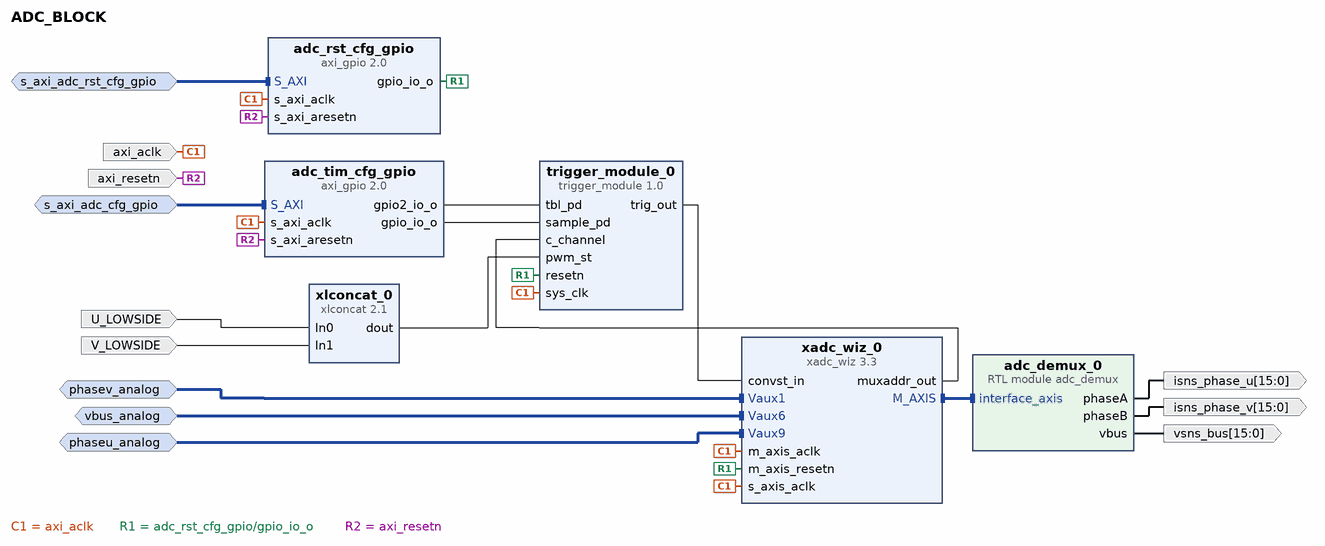
[diagram p0: block diagram of the top level]
# Vivado block design ADC_BLOCK, xc7z020clg400-1, Vivado 2021.2
create_bd_design ADC_BLOCK

create_bd_intf_port -mode Slave -vlnv xilinx.com:interface:diff_analog_io_rtl:1.0 phasev_analog
create_bd_intf_port -mode Slave -vlnv xilinx.com:interface:diff_analog_io_rtl:1.0 vbus_analog
create_bd_intf_port -mode Slave -vlnv xilinx.com:interface:diff_analog_io_rtl:1.0 phaseu_analog
create_bd_intf_port -mode Slave -vlnv xilinx.com:interface:aximm_rtl:1.0 s_axi_adc_cfg_gpio
set_property -dict [list \
  CONFIG.ADDR_WIDTH 9 \
  CONFIG.ARUSER_WIDTH 0 \
  CONFIG.AWUSER_WIDTH 0 \
  CONFIG.BUSER_WIDTH 0 \
  CONFIG.DATA_WIDTH 32 \
  CONFIG.HAS_BRESP 1 \
  CONFIG.HAS_BURST 0 \
  CONFIG.HAS_CACHE 0 \
  CONFIG.HAS_LOCK 0 \
  CONFIG.HAS_PROT 0 \
  CONFIG.HAS_QOS 0 \
  CONFIG.HAS_REGION 0 \
  CONFIG.HAS_RRESP 1 \
  CONFIG.HAS_WSTRB 1 \
  CONFIG.ID_WIDTH 0 \
  CONFIG.MAX_BURST_LENGTH 1 \
  CONFIG.NUM_READ_OUTSTANDING 1 \
  CONFIG.NUM_READ_THREADS 1 \
  CONFIG.NUM_WRITE_OUTSTANDING 1 \
  CONFIG.NUM_WRITE_THREADS 1 \
  CONFIG.PROTOCOL AXI4LITE \
  CONFIG.READ_WRITE_MODE READ_WRITE \
  CONFIG.RUSER_BITS_PER_BYTE 0 \
  CONFIG.RUSER_WIDTH 0 \
  CONFIG.SUPPORTS_NARROW_BURST 0 \
  CONFIG.WUSER_BITS_PER_BYTE 0 \
  CONFIG.WUSER_WIDTH 0 \
] [get_bd_intf_ports s_axi_adc_cfg_gpio]
create_bd_intf_port -mode Slave -vlnv xilinx.com:interface:aximm_rtl:1.0 s_axi_adc_rst_cfg_gpio
set_property -dict [list \
  CONFIG.ADDR_WIDTH 9 \
  CONFIG.ARUSER_WIDTH 0 \
  CONFIG.AWUSER_WIDTH 0 \
  CONFIG.BUSER_WIDTH 0 \
  CONFIG.DATA_WIDTH 32 \
  CONFIG.HAS_BRESP 1 \
  CONFIG.HAS_BURST 0 \
  CONFIG.HAS_CACHE 0 \
  CONFIG.HAS_LOCK 0 \
  CONFIG.HAS_PROT 0 \
  CONFIG.HAS_QOS 0 \
  CONFIG.HAS_REGION 0 \
  CONFIG.HAS_RRESP 1 \
  CONFIG.HAS_WSTRB 1 \
  CONFIG.ID_WIDTH 0 \
  CONFIG.MAX_BURST_LENGTH 1 \
  CONFIG.NUM_READ_OUTSTANDING 1 \
  CONFIG.NUM_READ_THREADS 1 \
  CONFIG.NUM_WRITE_OUTSTANDING 1 \
  CONFIG.NUM_WRITE_THREADS 1 \
  CONFIG.PROTOCOL AXI4LITE \
  CONFIG.READ_WRITE_MODE READ_WRITE \
  CONFIG.RUSER_BITS_PER_BYTE 0 \
  CONFIG.RUSER_WIDTH 0 \
  CONFIG.SUPPORTS_NARROW_BURST 0 \
  CONFIG.WUSER_BITS_PER_BYTE 0 \
  CONFIG.WUSER_WIDTH 0 \
] [get_bd_intf_ports s_axi_adc_rst_cfg_gpio]
create_bd_port -dir I U_LOWSIDE
create_bd_port -dir I V_LOWSIDE
create_bd_port -dir I -type clk axi_aclk
set_property -dict [list \
  CONFIG.ASSOCIATED_BUSIF s_axi_adc_rst_cfg_gpio:s_axi_adc_cfg_gpio \
  CONFIG.FREQ_HZ 100000000 \
] [get_bd_ports axi_aclk]
create_bd_port -dir I -type rst axi_resetn
create_bd_port -dir O -from 15 -to 0 -type data isns_phase_u
create_bd_port -dir O -from 15 -to 0 -type data isns_phase_v
create_bd_port -dir O -from 15 -to 0 -type data vsns_bus

create_bd_cell -type ip -vlnv xilinx.com:ip:xadc_wiz:3.3 xadc_wiz_0
set_property -dict [list \
  CONFIG.CHANNEL_ENABLE_VAUXP1_VAUXN1 true \
  CONFIG.CHANNEL_ENABLE_VAUXP6_VAUXN6 true \
  CONFIG.CHANNEL_ENABLE_VAUXP9_VAUXN9 true \
  CONFIG.CHANNEL_ENABLE_VP_VN false \
  CONFIG.ENABLE_AXI4STREAM true \
  CONFIG.ENABLE_RESET true \
  CONFIG.ENABLE_VBRAM_ALARM false \
  CONFIG.ENABLE_VCCDDRO_ALARM false \
  CONFIG.ENABLE_VCCPAUX_ALARM false \
  CONFIG.ENABLE_VCCPINT_ALARM false \
  CONFIG.EXTERNAL_MUXADDR_ENABLE true \
  CONFIG.EXTERNAL_MUX_CHANNEL VP_VN \
  CONFIG.INTERFACE_SELECTION None \
  CONFIG.OT_ALARM false \
  CONFIG.SEQUENCER_MODE Continuous \
  CONFIG.SINGLE_CHANNEL_SELECTION TEMPERATURE \
  CONFIG.TIMING_MODE Event \
  CONFIG.USER_TEMP_ALARM false \
  CONFIG.VCCAUX_ALARM false \
  CONFIG.VCCINT_ALARM false \
  CONFIG.XADC_STARUP_SELECTION channel_sequencer \
] [get_bd_cells xadc_wiz_0]
create_bd_cell -type ip -vlnv xilinx.com:user:trigger_module:1.0 trigger_module_0
create_bd_cell -type module -reference adc_demux adc_demux_0
create_bd_cell -type ip -vlnv xilinx.com:ip:xlconcat:2.1 xlconcat_0
create_bd_cell -type ip -vlnv xilinx.com:ip:axi_gpio:2.0 adc_rst_cfg_gpio
set_property -dict {CONFIG.C_ALL_OUTPUTS 1 CONFIG.C_GPIO_WIDTH 1} [get_bd_cells adc_rst_cfg_gpio]
create_bd_cell -type ip -vlnv xilinx.com:ip:axi_gpio:2.0 adc_tim_cfg_gpio
set_property -dict {CONFIG.C_ALL_OUTPUTS 1 CONFIG.C_ALL_OUTPUTS_2 1 CONFIG.C_IS_DUAL 1} [get_bd_cells adc_tim_cfg_gpio]

# ---- connections ----

connect_bd_intf_net -intf_net S_AXI_0_1 [get_bd_intf_ports s_axi_adc_cfg_gpio] [get_bd_intf_pins adc_tim_cfg_gpio/S_AXI]
connect_bd_intf_net -intf_net S_AXI_1_1 [get_bd_intf_ports s_axi_adc_rst_cfg_gpio] [get_bd_intf_pins adc_rst_cfg_gpio/S_AXI]
connect_bd_intf_net -intf_net Vaux1_0_1 [get_bd_intf_ports phasev_analog] [get_bd_intf_pins xadc_wiz_0/Vaux1]
connect_bd_intf_net -intf_net Vaux6_0_1 [get_bd_intf_ports vbus_analog] [get_bd_intf_pins xadc_wiz_0/Vaux6]
connect_bd_intf_net -intf_net Vaux9_0_1 [get_bd_intf_ports phaseu_analog] [get_bd_intf_pins xadc_wiz_0/Vaux9]
connect_bd_intf_net [get_bd_intf_pins xadc_wiz_0/M_AXIS] [get_bd_intf_pins adc_demux_0/interface_axis]
connect_bd_net [get_bd_ports axi_aclk] \
  [get_bd_pins xadc_wiz_0/m_axis_aclk] [get_bd_pins trigger_module_0/sys_clk] [get_bd_pins xadc_wiz_0/s_axis_aclk] \
  [get_bd_pins adc_tim_cfg_gpio/s_axi_aclk] [get_bd_pins adc_rst_cfg_gpio/s_axi_aclk]
connect_bd_net [get_bd_pins adc_rst_cfg_gpio/gpio_io_o] [get_bd_pins xadc_wiz_0/m_axis_resetn] [get_bd_pins trigger_module_0/resetn]
connect_bd_net [get_bd_ports U_LOWSIDE] [get_bd_pins xlconcat_0/In0]
connect_bd_net [get_bd_ports V_LOWSIDE] [get_bd_pins xlconcat_0/In1]
connect_bd_net [get_bd_pins adc_demux_0/phaseA] [get_bd_ports isns_phase_u]
connect_bd_net [get_bd_pins adc_demux_0/phaseB] [get_bd_ports isns_phase_v]
connect_bd_net [get_bd_pins adc_demux_0/vbus] [get_bd_ports vsns_bus]
connect_bd_net [get_bd_pins adc_tim_cfg_gpio/gpio2_io_o] [get_bd_pins trigger_module_0/tbl_pd]
connect_bd_net [get_bd_pins adc_tim_cfg_gpio/gpio_io_o] [get_bd_pins trigger_module_0/sample_pd]
connect_bd_net [get_bd_ports axi_resetn] [get_bd_pins adc_tim_cfg_gpio/s_axi_aresetn] [get_bd_pins adc_rst_cfg_gpio/s_axi_aresetn]
connect_bd_net [get_bd_pins trigger_module_0/trig_out] [get_bd_pins xadc_wiz_0/convst_in]
connect_bd_net [get_bd_pins xadc_wiz_0/muxaddr_out] [get_bd_pins trigger_module_0/c_channel]
connect_bd_net [get_bd_pins xlconcat_0/dout] [get_bd_pins trigger_module_0/pwm_st]

validate_bd_design
save_bd_design
